# Altium project beat-box-pcb.PrjPcb
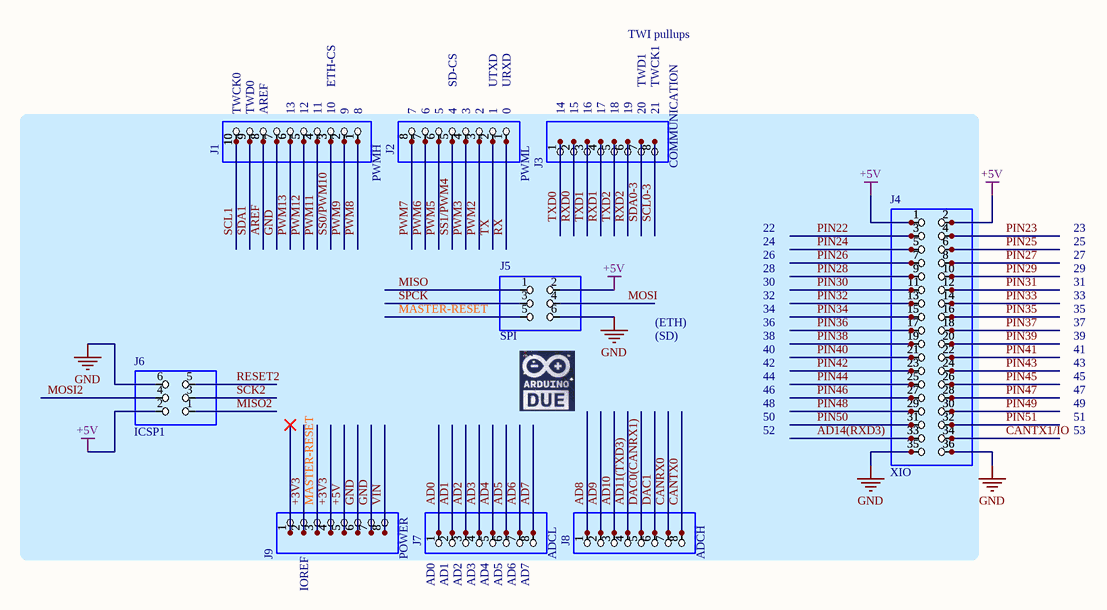
[diagram p0: Arduino.SchDoc]
2 sheets, 64 parts. Net scope: global (net labels, ports and power ports of the same name join across sheets).
Board file: PCB.PcbDoc
Sheets:
  Arduino.SchDoc
  Beat Box Schematic.SchDoc

## Sheet Arduino.SchDoc
size Letter

### Parts
J1  PWMH  [1X10]
J2  PWML  [1X08]
J3  COMMUNICATION  [1X08]
J4  XIO  [2X18]
J5  SPI  [2X03]
J6  ICSP1  [2X03]
J7  ADCL  [1X08]
J8  ADCH  [1X08]
J9  POWER  [1X08]

### Nets
+5V: J4.1 J4.2 J5.2 J6.2 J9.5
GND: J1.7 J4.35 J4.36 J5.6 J6.6 J9.6 J9.7
+3V3: J9.2 J9.4
AD0: J7.1
AD1: J7.2
AD2: J7.3
AD3: J7.4
AD4: J7.5
AD5: J7.6
AD6: J7.7
AD7: J7.8
AD8: J8.1
AD9: J8.2
AD10: J8.3
AD11(TXD3): J8.4
AD14(RXD3): J4.33
AREF: J1.8
CANRX0: J8.7
CANTX0: J8.8
CANTX1/IO: J4.34
DAC0(CANRX1): J8.5
DAC1: J8.6
MASTER-RESET: J5.5 J9.3
MISO: J5.1
MISO2: J6.1
MOSI: J5.4
MOSI2: J6.4
PIN22: J4.3
PIN23: J4.4
PIN24: J4.5
PIN25: J4.6
PIN26: J4.7
PIN27: J4.8
PIN28: J4.9
PIN29: J4.10
PIN30: J4.11
PIN31: J4.12
PIN32: J4.13
PIN33: J4.14
PIN34: J4.15
PIN35: J4.16
PIN36: J4.17
PIN37: J4.18
PIN38: J4.19
PIN39: J4.20
PIN40: J4.21
PIN41: J4.22
PIN42: J4.23
PIN43: J4.24
PIN44: J4.25
PIN45: J4.26
PIN46: J4.27
PIN47: J4.28
PIN48: J4.29
PIN49: J4.30
PIN50: J4.31
PIN51: J4.32
PWM2: J2.3
PWM3: J2.4
PWM5: J2.6
PWM6: J2.7
PWM7: J2.8
PWM8: J1.1
PWM9: J1.2
PWM11: J1.4
PWM12: J1.5
PWM13: J1.6
RESET2: J6.5
RX: J2.1
RXD0: J3.2
RXD1: J3.4
RXD2: J3.6
SCK2: J6.3
SCL0-3: J3.8
SCL1: J1.10
SDA0-3: J3.7
SDA1: J1.9
SPCK: J5.3
SS0/PWM10: J1.3
SS1/PWM4: J2.5
TX: J2.2
TXD0: J3.1
TXD1: J3.3
TXD2: J3.5
VIN: J9.8

Not connected (* = marked no-connect by the designer): J9 1*

### Notes on the sheet
- TWI pullups
- (near J1) TWCK0
- (near J1) TWD0
- (near J1) AREF
- (near J1) 13
- (near J1) 12
- (near J1) 11
- (near J1) 10
- (near J1) ETH-CS
- (near J1) 9
- (near J1) 8
- (near J2) 7
- (near J2) 6
- (near J2) 5
- (near J2) 4
- (near J2) SD-CS
- (near J2) 3
- (near J2) 2
- (near J2) 1
- (near J2) UTXD
- (near J2) 0
- (near J2) URXD
- 14
- 15
- (near J3) 16
- (near J3) 17
- (near J3) 18
- (near J3) 19
- (near J3) 20
- TWD1
- (near J3) 21
- TWCK1
- 22
- 24
- 26
- 28
- 23
- 25
- 27
- 29
- (ETH)
- (SD)
- 30
- 32
- 34
- 36
- 38
- 31
- 33
- 35
- 37
- 39
- 48
- 46
- 44
- 42
- 40
- 49
- 47
- 45
- 43
- 41
- 52
- 50
- 51
- 53
- (near J9) IOREF
- (near J7) AD0
- (near J7) AD1
- (near J7) AD2
- (near J7) AD3
- (near J7) AD4
- (near J7) AD5
- (near J7) AD6
- (near J7) AD7

### Library data of the parts
J1 = PINHD-1X10
J2 J3 J7-J9 = PINHD-1X8
J4 = PINHD-2X18
J5 J6 = PINHD-2X3

## Sheet Beat Box Schematic.SchDoc
size B
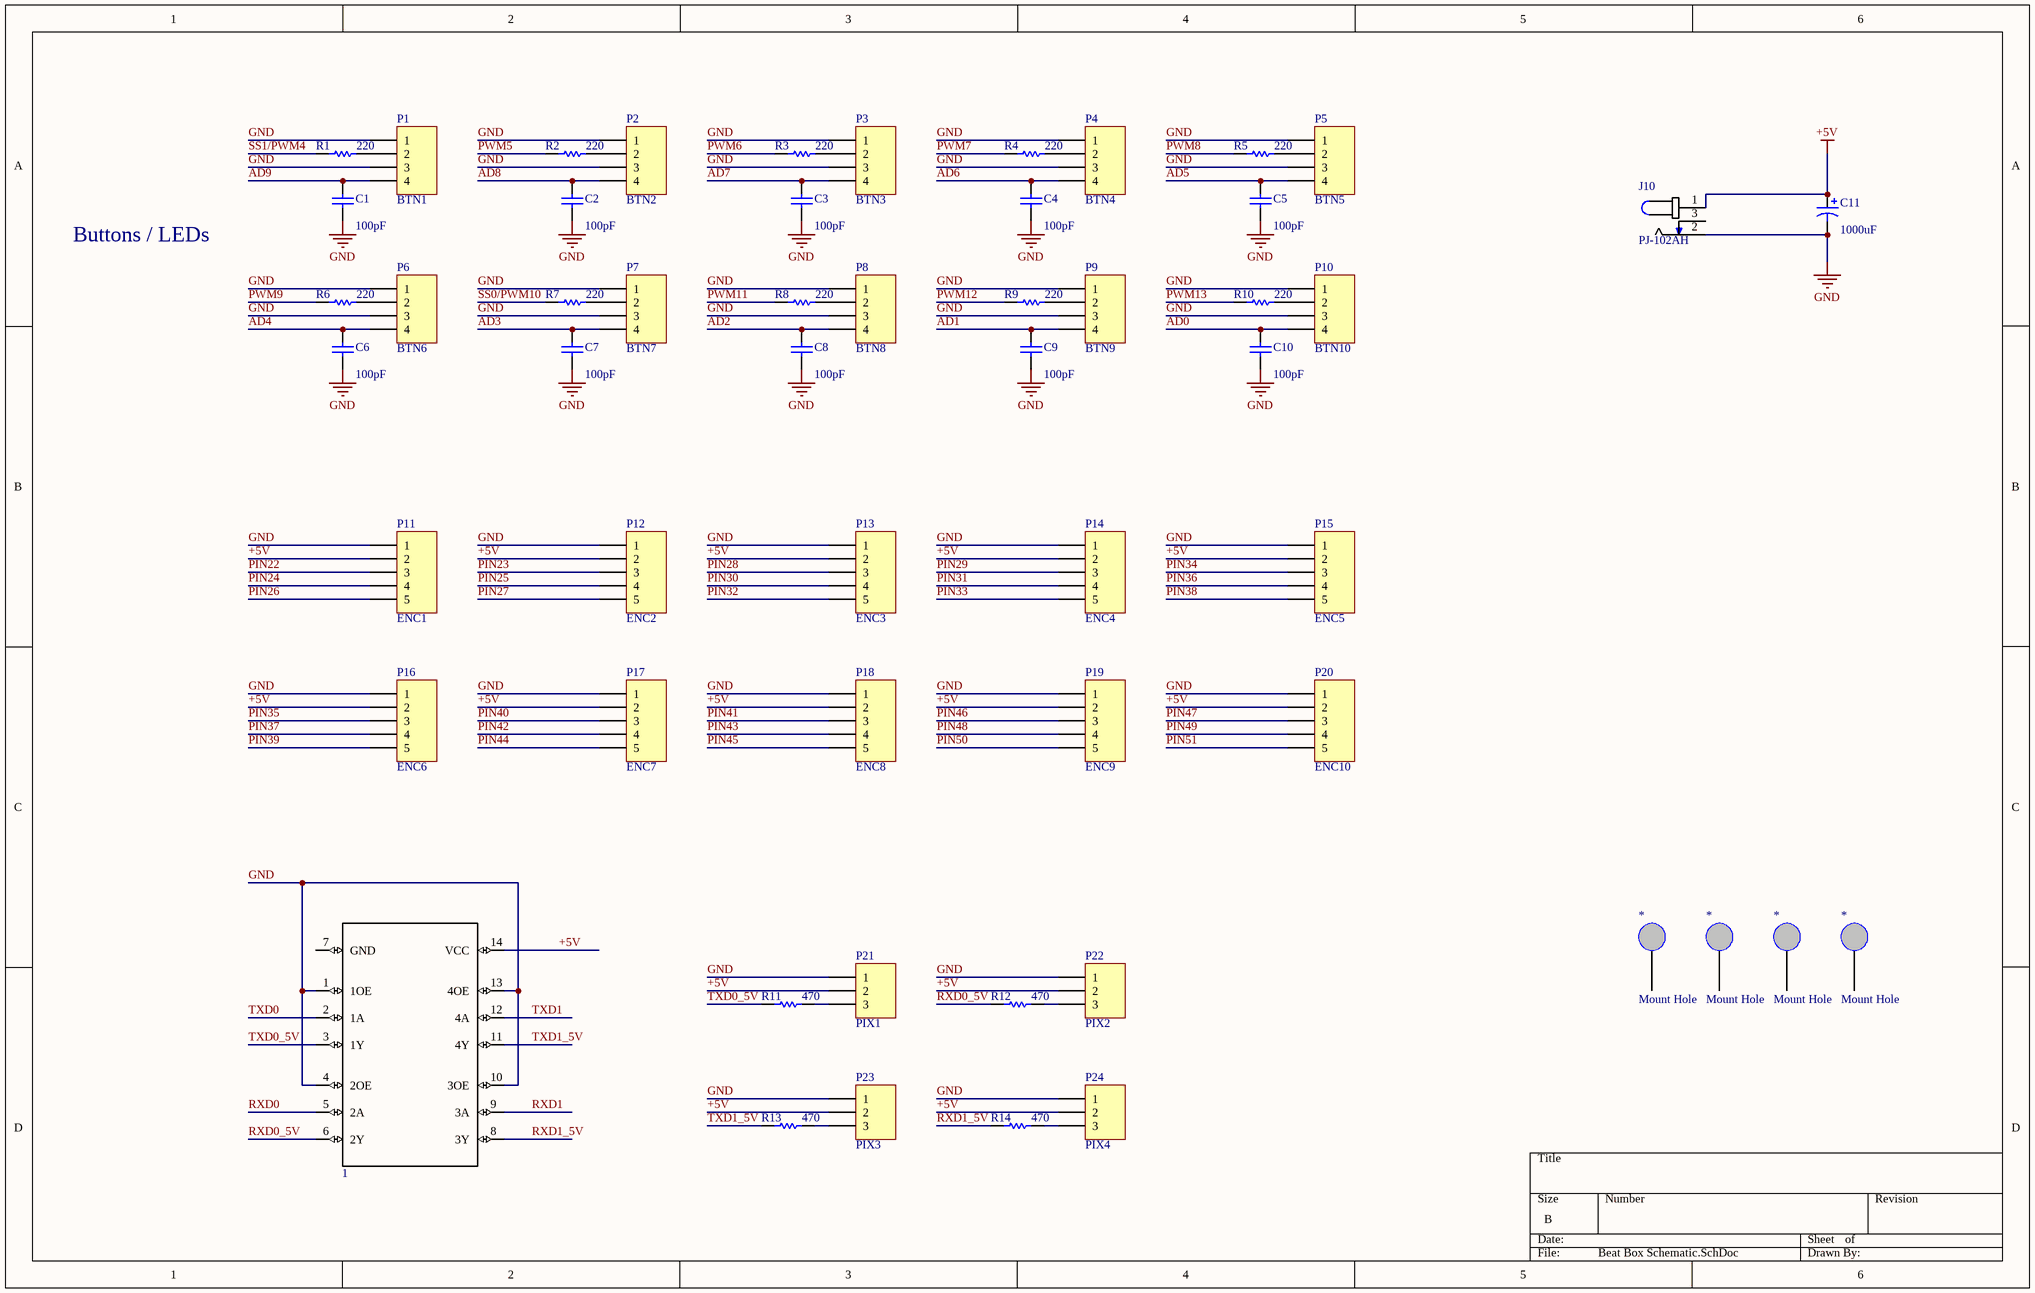
[diagram p1: Beat Box Schematic.SchDoc]

### Parts
(Parts that share a designator on the sheet are numbered #1, #2 ... from top to bottom, then left to right.)
1  74AHC125  [*14DIP]  (value not drawn)
*#1  Mount Hole  [6-32 Mount Hole]
*#2  Mount Hole  [6-32 Mount Hole]
*#3  Mount Hole  [6-32 Mount Hole]
*#4  Mount Hole  [6-32 Mount Hole]
C1  value 100pF  [RAD-0.2]  (hidden comment: Cap)
C2  value 100pF  [RAD-0.2]  (hidden comment: Cap)
C3  value 100pF  [RAD-0.2]  (hidden comment: Cap)
C4  value 100pF  [RAD-0.2]  (hidden comment: Cap)
C5  value 100pF  [RAD-0.2]  (hidden comment: Cap)
C6  value 100pF  [RAD-0.2]  (hidden comment: Cap)
C7  value 100pF  [RAD-0.2]  (hidden comment: Cap)
C8  value 100pF  [RAD-0.2]  (hidden comment: Cap)
C9  value 100pF  [RAD-0.2]  (hidden comment: Cap)
C10  value 100pF  [RAD-0.2]  (hidden comment: Cap)
C11  value 1000uF  [RB7.6-15]  (hidden comment: Cap Pol1)
J10  PJ-102AH  [*CUI_PJ-102AH]
P1  BTN1  [HDR1X4]
P2  BTN2  [HDR1X4]
P3  BTN3  [HDR1X4]
P4  BTN4  [HDR1X4]
P5  BTN5  [HDR1X4]
P6  BTN6  [HDR1X4]
P7  BTN7  [HDR1X4]
P8  BTN8  [HDR1X4]
P9  BTN9  [HDR1X4]
P10  BTN10  [HDR1X4]
P11  ENC1  [HDR1X5]
P12  ENC2  [HDR1X5]
P13  ENC3  [HDR1X5]
P14  ENC4  [HDR1X5]
P15  ENC5  [HDR1X5]
P16  ENC6  [HDR1X5]
P17  ENC7  [HDR1X5]
P18  ENC8  [HDR1X5]
P19  ENC9  [HDR1X5]
P20  ENC10  [HDR1X5]
P21  PIX1  [HDR1X3]
P22  PIX2  [HDR1X3]
P23  PIX3  [HDR1X3]
P24  PIX4  [HDR1X3]
R1  value 220  [AXIAL-0.3]  (hidden comment: Res1)
R2  value 220  [AXIAL-0.3]  (hidden comment: Res1)
R3  value 220  [AXIAL-0.3]  (hidden comment: Res1)
R4  value 220  [AXIAL-0.3]  (hidden comment: Res1)
R5  value 220  [AXIAL-0.3]  (hidden comment: Res1)
R6  value 220  [AXIAL-0.3]  (hidden comment: Res1)
R7  value 220  [AXIAL-0.3]  (hidden comment: Res1)
R8  value 220  [AXIAL-0.3]  (hidden comment: Res1)
R9  value 220  [AXIAL-0.3]  (hidden comment: Res1)
R10  value 220  [AXIAL-0.3]  (hidden comment: Res1)
R11  value 470  [AXIAL-0.3]  (hidden comment: Res1)
R12  value 470  [AXIAL-0.3]  (hidden comment: Res1)
R13  value 470  [AXIAL-0.3]  (hidden comment: Res1)
R14  value 470  [AXIAL-0.3]  (hidden comment: Res1)

### Nets
+5V: 1.14(VCC) C11.1 J10.1 P11.2 P12.2 P13.2 P14.2 P15.2 P16.2 P17.2 P18.2 P19.2 P20.2 P21.2 P22.2 P23.2 P24.2
GND: 1.1(1OE) 1.4(2OE) 1.10(3OE) 1.13(4OE) C1.1 C2.1 C3.1 C4.1 C5.1 C6.1 C7.1 C8.1 C9.1 C10.1 C11.2 J10.2 P1.1 P1.3 P2.1 P2.3 P3.1 P3.3 P4.1 P4.3 P5.1 P5.3 P6.1 P6.3 P7.1 P7.3 P8.1 P8.3 P9.1 P9.3 P10.1 P10.3 P11.1 P12.1 P13.1 P14.1 P15.1 P16.1 P17.1 P18.1 P19.1 P20.1 P21.1 P22.1 P23.1 P24.1
AD0: C10.2 P10.4
AD1: C9.2 P9.4
AD2: C8.2 P8.4
AD3: C7.2 P7.4
AD4: C6.2 P6.4
AD5: C5.2 P5.4
AD6: C4.2 P4.4
AD7: C3.2 P3.4
AD8: C2.2 P2.4
AD9: C1.2 P1.4
PIN22: P11.3
PIN23: P12.3
PIN24: P11.4
PIN25: P12.4
PIN26: P11.5
PIN27: P12.5
PIN28: P13.3
PIN29: P14.3
PIN30: P13.4
PIN31: P14.4
PIN32: P13.5
PIN33: P14.5
PIN34: P15.3
PIN35: P16.3
PIN36: P15.4
PIN37: P16.4
PIN38: P15.5
PIN39: P16.5
PIN40: P17.3
PIN41: P18.3
PIN42: P17.4
PIN43: P18.4
PIN44: P17.5
PIN45: P18.5
PIN46: P19.3
PIN47: P20.3
PIN48: P19.4
PIN49: P20.4
PIN50: P19.5
PIN51: P20.5
PWM5: R2.1
PWM6: R3.1
PWM7: R4.1
PWM8: R5.1
PWM9: R6.1
PWM11: R8.1
PWM12: R9.1
PWM13: R10.1
RXD0: 1.5(2A)
RXD0_5V: 1.6(2Y) R12.1
RXD1: 1.9(3A)
RXD1_5V: 1.8(3Y) R14.1
SS0/PWM10: R7.1
SS1/PWM4: R1.1
TXD0: 1.2(1A)
TXD0_5V: 1.3(1Y) R11.1
TXD1: 1.12(4A)
TXD1_5V: 1.11(4Y) R13.1
NetP1_2: P1.2 R1.2
NetP2_2: P2.2 R2.2
NetP3_2: P3.2 R3.2
NetP4_2: P4.2 R4.2
NetP5_2: P5.2 R5.2
NetP6_2: P6.2 R6.2
NetP7_2: P7.2 R7.2
NetP8_2: P8.2 R8.2
NetP9_2: P9.2 R9.2
NetP10_2: P10.2 R10.2
NetP21_3: P21.3 R11.2
NetP22_3: P22.3 R12.2
NetP23_3: P23.3 R13.2
NetP24_3: P24.3 R14.2

Not connected (* = marked no-connect by the designer): 1 7(GND); *#1 0; *#2 0; *#3 0; *#4 0; J10 3

### Notes on the sheet
- Buttons / LEDs

### Library data of the parts
1 = 74AHC125: MF: Texas Instruments; Package: TSSOP-14 Texas Instruments; MP: 74AHC125; SnapEDA_Link: https://www.snapeda.com/parts/74AHC125/Texas%20Instruments/view-part/?ref=snap; Price: None; Availability: Unavailable; Value: *
C1-C10 = Cap: Capacitor; Published: 8-Jun-2000; LatestRevisionDate: 17-Jul-2002; LatestRevisionNote: Re-released for DXP Platform.; PackageReference: RAD-0.3; Publisher: Altium Limited; PackageDescription: Radial Cap, Thru-Hole; 2 Leads; 0.3 in Pin Spacing
C11 = Cap Pol1: Polarized Capacitor (Radial); Published: 8-Jun-2000; LatestRevisionDate: 17-Jul-2002; LatestRevisionNote: Re-released for DXP Platform.; PackageReference: RB7.6-15; Publisher: Altium Limited; PackageDescription: Polarized Capacitor (Radial); 2 Leads
P1-P10 = Header 4: Header, 4-Pin; LatestRevisionDate: 17-Jul-2002; LatestRevisionNote: Re-released for DXP Platform.; Publisher: Altium Limited
P11-P20 = Header 5: Header, 5-Pin; LatestRevisionDate: 17-Jul-2002; LatestRevisionNote: Re-released for DXP Platform.; Publisher: Altium Limited
P21-P24 = Header 3: Header, 3-Pin; LatestRevisionDate: 17-Jul-2002; LatestRevisionNote: Re-released for DXP Platform.; Publisher: Altium Limited
R1-R14 = Res1: Resistor; Published: 8-Jun-2000; LatestRevisionDate: 17-Jul-2002; LatestRevisionNote: Re-released for DXP Platform.; PackageReference: AXIAL-0.3; Publisher: Altium Limited; PackageDescription: Axial Device, Thru-Hole; 2 Leads; 0.3 in Pin Spacing
J10 = PJ-102AH: Value: *

## Nets that join several sheets
+5V: Arduino (5 pins), Beat Box Schematic (17 pins)
GND: Arduino (7 pins), Beat Box Schematic (50 pins)
AD0: Arduino (J7.1), Beat Box Schematic (C10.2 P10.4)
AD1: Arduino (J7.2), Beat Box Schematic (C9.2 P9.4)
AD2: Arduino (J7.3), Beat Box Schematic (C8.2 P8.4)
AD3: Arduino (J7.4), Beat Box Schematic (C7.2 P7.4)
AD4: Arduino (J7.5), Beat Box Schematic (C6.2 P6.4)
AD5: Arduino (J7.6), Beat Box Schematic (C5.2 P5.4)
AD6: Arduino (J7.7), Beat Box Schematic (C4.2 P4.4)
AD7: Arduino (J7.8), Beat Box Schematic (C3.2 P3.4)
AD8: Arduino (J8.1), Beat Box Schematic (C2.2 P2.4)
AD9: Arduino (J8.2), Beat Box Schematic (C1.2 P1.4)
PIN22: Arduino (J4.3), Beat Box Schematic (P11.3)
PIN23: Arduino (J4.4), Beat Box Schematic (P12.3)
PIN24: Arduino (J4.5), Beat Box Schematic (P11.4)
PIN25: Arduino (J4.6), Beat Box Schematic (P12.4)
PIN26: Arduino (J4.7), Beat Box Schematic (P11.5)
PIN27: Arduino (J4.8), Beat Box Schematic (P12.5)
PIN28: Arduino (J4.9), Beat Box Schematic (P13.3)
PIN29: Arduino (J4.10), Beat Box Schematic (P14.3)
PIN30: Arduino (J4.11), Beat Box Schematic (P13.4)
PIN31: Arduino (J4.12), Beat Box Schematic (P14.4)
PIN32: Arduino (J4.13), Beat Box Schematic (P13.5)
PIN33: Arduino (J4.14), Beat Box Schematic (P14.5)
PIN34: Arduino (J4.15), Beat Box Schematic (P15.3)
PIN35: Arduino (J4.16), Beat Box Schematic (P16.3)
PIN36: Arduino (J4.17), Beat Box Schematic (P15.4)
PIN37: Arduino (J4.18), Beat Box Schematic (P16.4)
PIN38: Arduino (J4.19), Beat Box Schematic (P15.5)
PIN39: Arduino (J4.20), Beat Box Schematic (P16.5)
PIN40: Arduino (J4.21), Beat Box Schematic (P17.3)
PIN41: Arduino (J4.22), Beat Box Schematic (P18.3)
PIN42: Arduino (J4.23), Beat Box Schematic (P17.4)
PIN43: Arduino (J4.24), Beat Box Schematic (P18.4)
PIN44: Arduino (J4.25), Beat Box Schematic (P17.5)
PIN45: Arduino (J4.26), Beat Box Schematic (P18.5)
PIN46: Arduino (J4.27), Beat Box Schematic (P19.3)
PIN47: Arduino (J4.28), Beat Box Schematic (P20.3)
PIN48: Arduino (J4.29), Beat Box Schematic (P19.4)
PIN49: Arduino (J4.30), Beat Box Schematic (P20.4)
PIN50: Arduino (J4.31), Beat Box Schematic (P19.5)
PIN51: Arduino (J4.32), Beat Box Schematic (P20.5)
PWM5: Arduino (J2.6), Beat Box Schematic (R2.1)
PWM6: Arduino (J2.7), Beat Box Schematic (R3.1)
PWM7: Arduino (J2.8), Beat Box Schematic (R4.1)
PWM8: Arduino (J1.1), Beat Box Schematic (R5.1)
PWM9: Arduino (J1.2), Beat Box Schematic (R6.1)
PWM11: Arduino (J1.4), Beat Box Schematic (R8.1)
PWM12: Arduino (J1.5), Beat Box Schematic (R9.1)
PWM13: Arduino (J1.6), Beat Box Schematic (R10.1)
RXD0: Arduino (J3.2), Beat Box Schematic (1.5)
RXD1: Arduino (J3.4), Beat Box Schematic (1.9)
SS0/PWM10: Arduino (J1.3), Beat Box Schematic (R7.1)
SS1/PWM4: Arduino (J2.5), Beat Box Schematic (R1.1)
TXD0: Arduino (J3.1), Beat Box Schematic (1.2)
TXD1: Arduino (J3.3), Beat Box Schematic (1.12)